# EasyEDA schematic 1-Schematic_ESP32 Connecting PCB.json
TITLE: Sheet_1; REV: 1.0; Date: 2019-08-06; Sheet: 1/1; Drawn By: Berniedu24; Company: Your Company
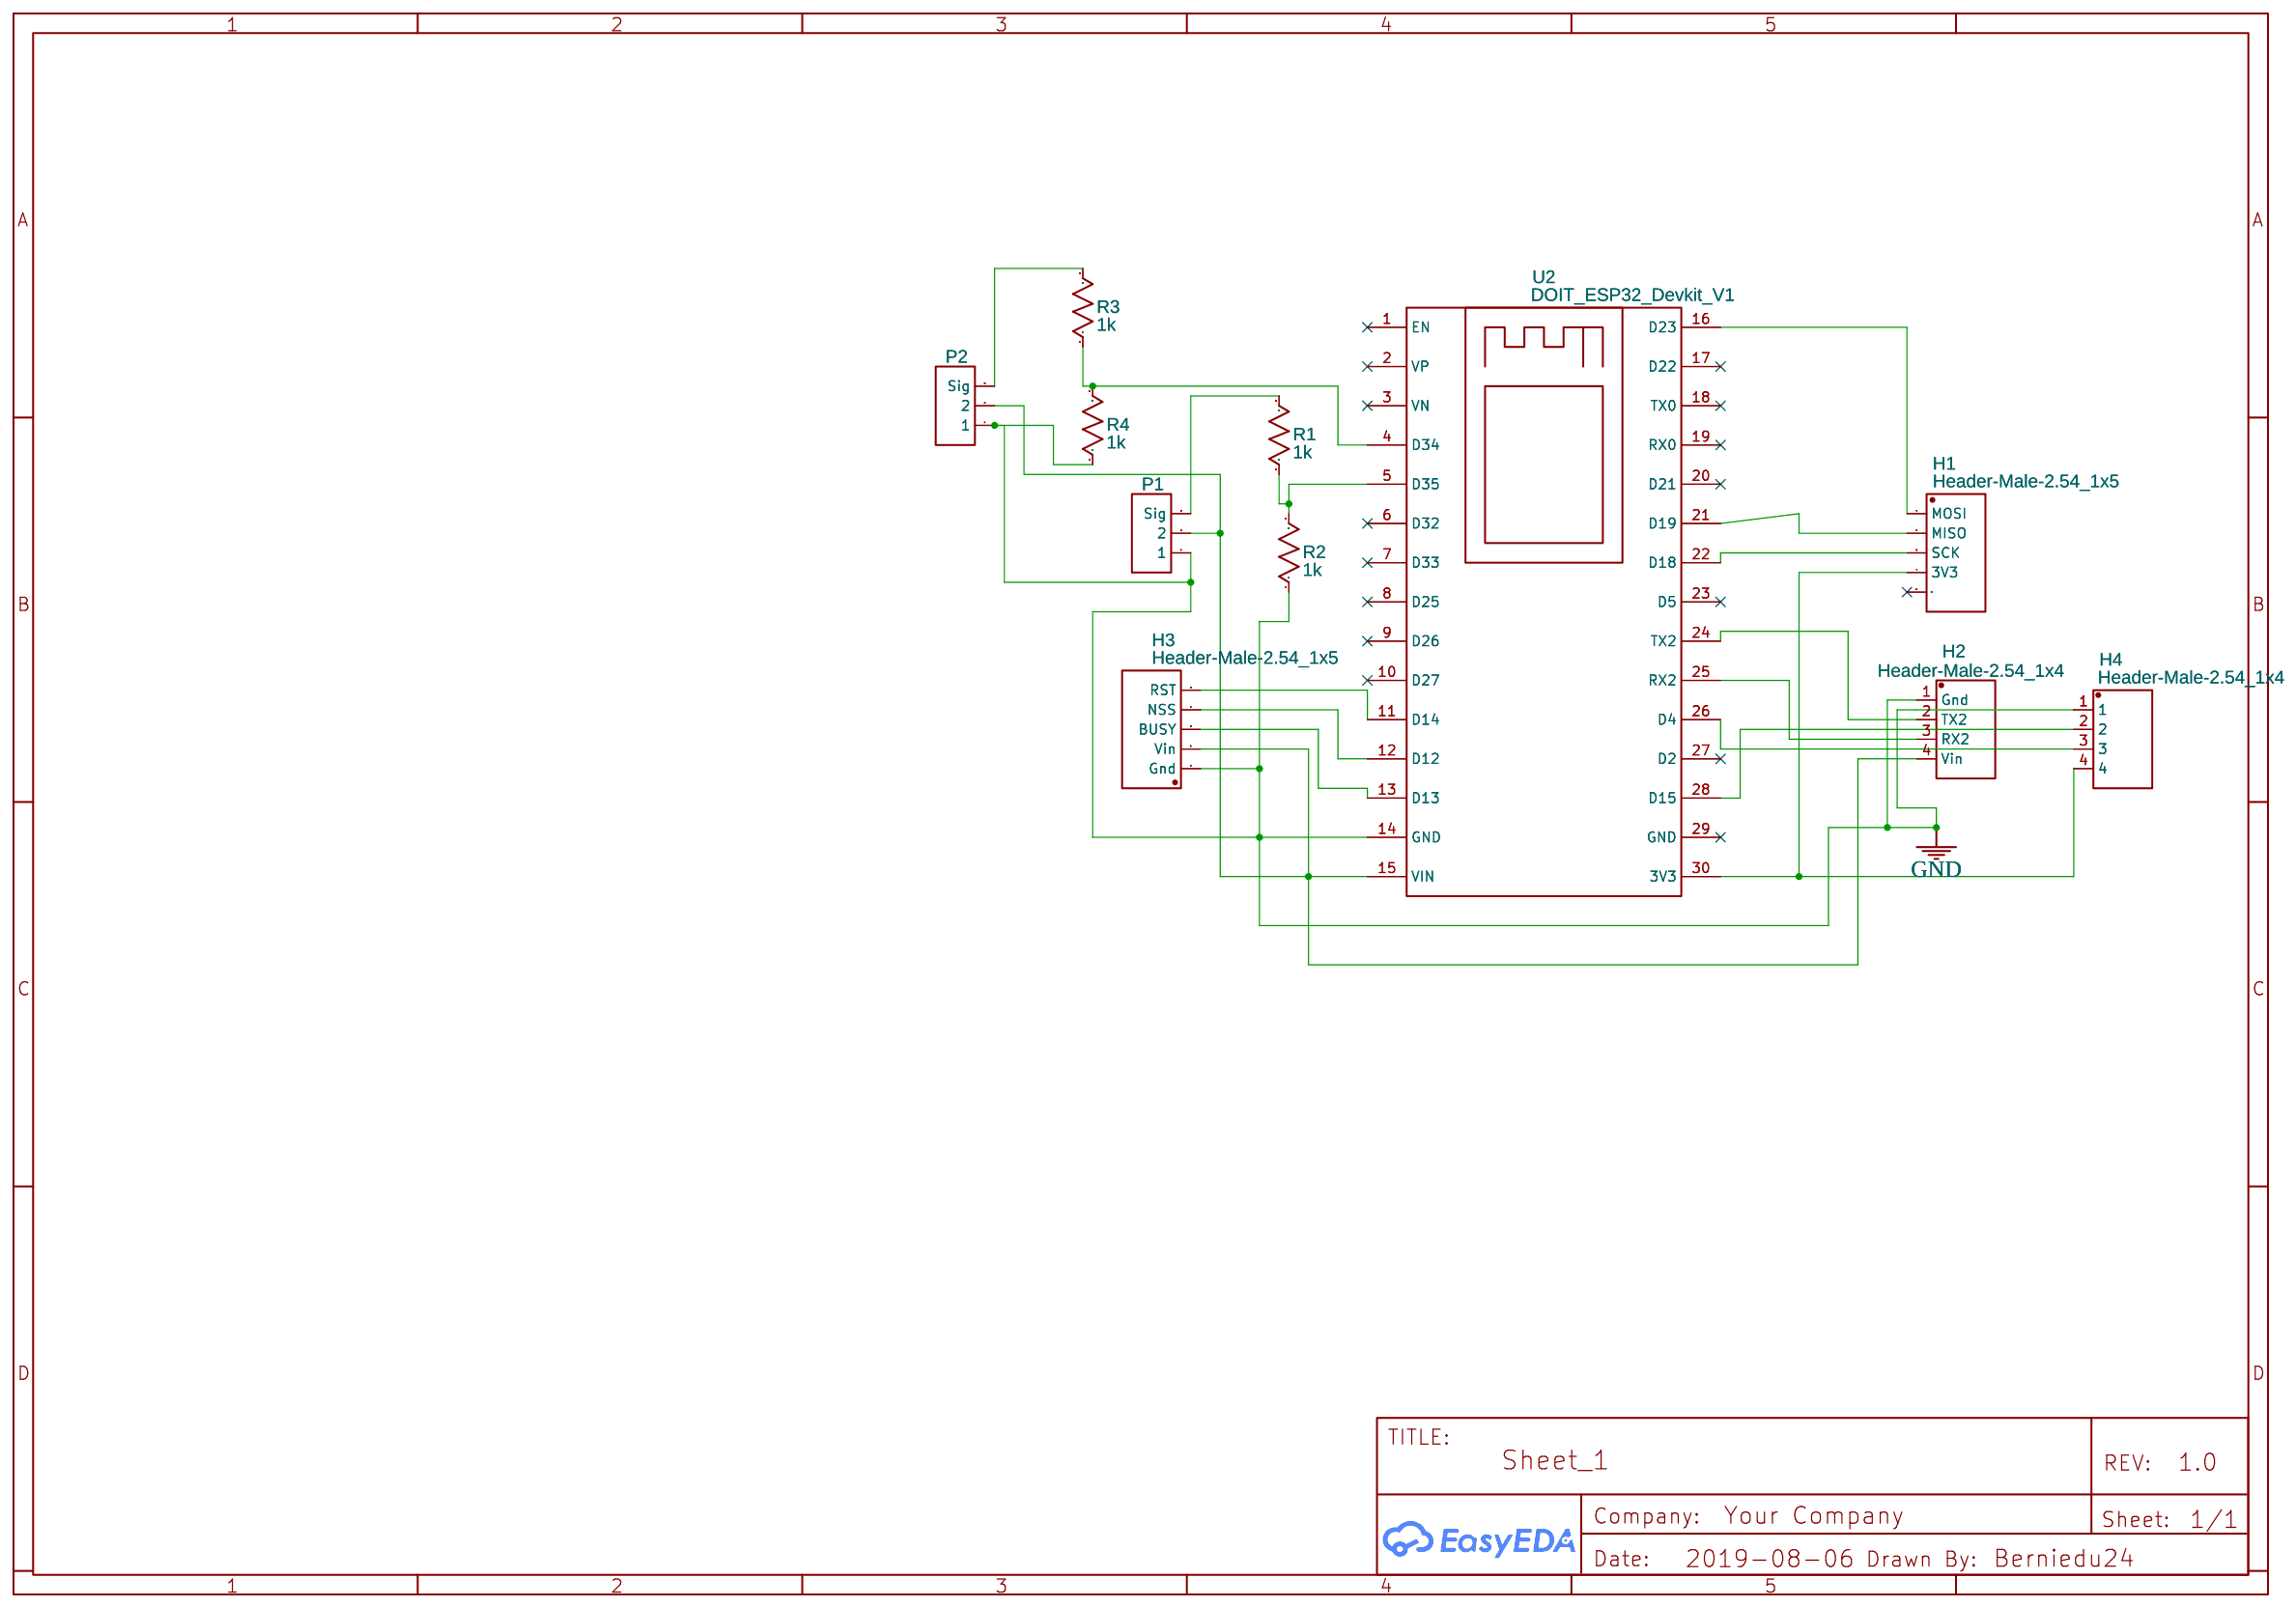
[diagram p0: schematic sheet]

## Parts
H1  Header-Male-2.54_1x5  [DIP-1X5P-2.54MM-M]
H2  Header-Male-2.54_1x4  [DIP-1X4P-2.54MM-M]
H3  Header-Male-2.54_1x5  [DIP-1X5P-2.54MM-M]
H4  Header-Male-2.54_1x4  [DIP-1X4P-2.54MM-M]
P1  Header-Male-2.54_1x3  [HDR-3X1/2.54]
P2  Header-Male-2.54_1x3  [HDR-3X1/2.54]
R1  1k  [AXIAL-0.4]
R2  1k  [AXIAL-0.4]
R3  1k  [AXIAL-0.4]
R4  1k  [AXIAL-0.4]
U2  DOIT_ESP32_Devkit_V1  [DOIT ESP32 DEVKIT V1]

## Library data of the parts
H1 H3 = -: Supplier: LCSC; Manufacturer: Ckmtw; Manufacturer Part: 210S-1*5P L=11.6MMGold-plated black; Contributor: LCSC; Supplier Part: C124379
H2 H4 = -: Supplier: LCSC; Manufacturer: Ckmtw; Manufacturer Part: 210S-1*4P L=11.6MMGold-plated black; Contributor: LCSC; Supplier Part: C124378
P1 P2 = -: Supplier: LCSC; Manufacturer: BOOMELE; Manufacturer Part: Header2.54mm 1*3P; image: //image.lceda.cn/szlcsc/C49257.jpg; Supplier Part: C49257
R1-R4 = Res_AXIAL-0.4(1/4W)_US
U2 = -: Manufacturer Part: ESP32; link: https://github.com/playelek/pinout-doit-32devkitv1/blob/master/pinoutDOIT32DevkitV1.pdf; Contributor: David Buzz

## Nets
GND: H2.1(Gnd) H3.1(Gnd) H4.1 P1.1 P2.1 R2.1 R4.1 U2.14(GND)
Net-(H1-1): H1.1(MOSI) U2.16(D23)
Net-(H1-2): H1.2(MISO) U2.21(D19)
Net-(H1-3): H1.3(SCK) U2.22(D18)
Net-(H1-4): H1.4(3V3) H4.4 U2.30(3V3)
Net-(H2-2): H2.2(TX2) U2.24(TX2)
Net-(H2-3): H2.3(RX2) U2.25(RX2)
Net-(H2-4): H2.4(Vin) H3.2(Vin) P1.2 P2.2 U2.15(VIN)
Net-(H3-3): H3.3(BUSY) U2.13(D13)
Net-(H3-4): H3.4(NSS) U2.12(D12)
Net-(H3-5): H3.5(RST) U2.11(D14)
Net-(H4-2): H4.2 U2.28(D15)
Net-(H4-3): H4.3 U2.26(D4)
Net-(P1-3): P1.3(Sig) R1.2
Net-(P2-3): P2.3(Sig) R3.2
Net-(R1-1): R1.1 R2.2 U2.5(D35)
Net-(R3-1): R3.1 R4.2 U2.4(D34)

Not connected (* = marked no-connect by the designer): H1 5(NC)*; U2 1(EN)* 2(VP)* 3(VN)* 6(D32)* 7(D33)* 8(D25)* 9(D26)* 10(D27)* 17(D22)* 18(TX0)* 19(RX0)* 20(D21)* 23(D5)* 27(D2)* 29(GND)*
